# EAGLE schematic p8x-led-card (EAGLE 9.6.2)
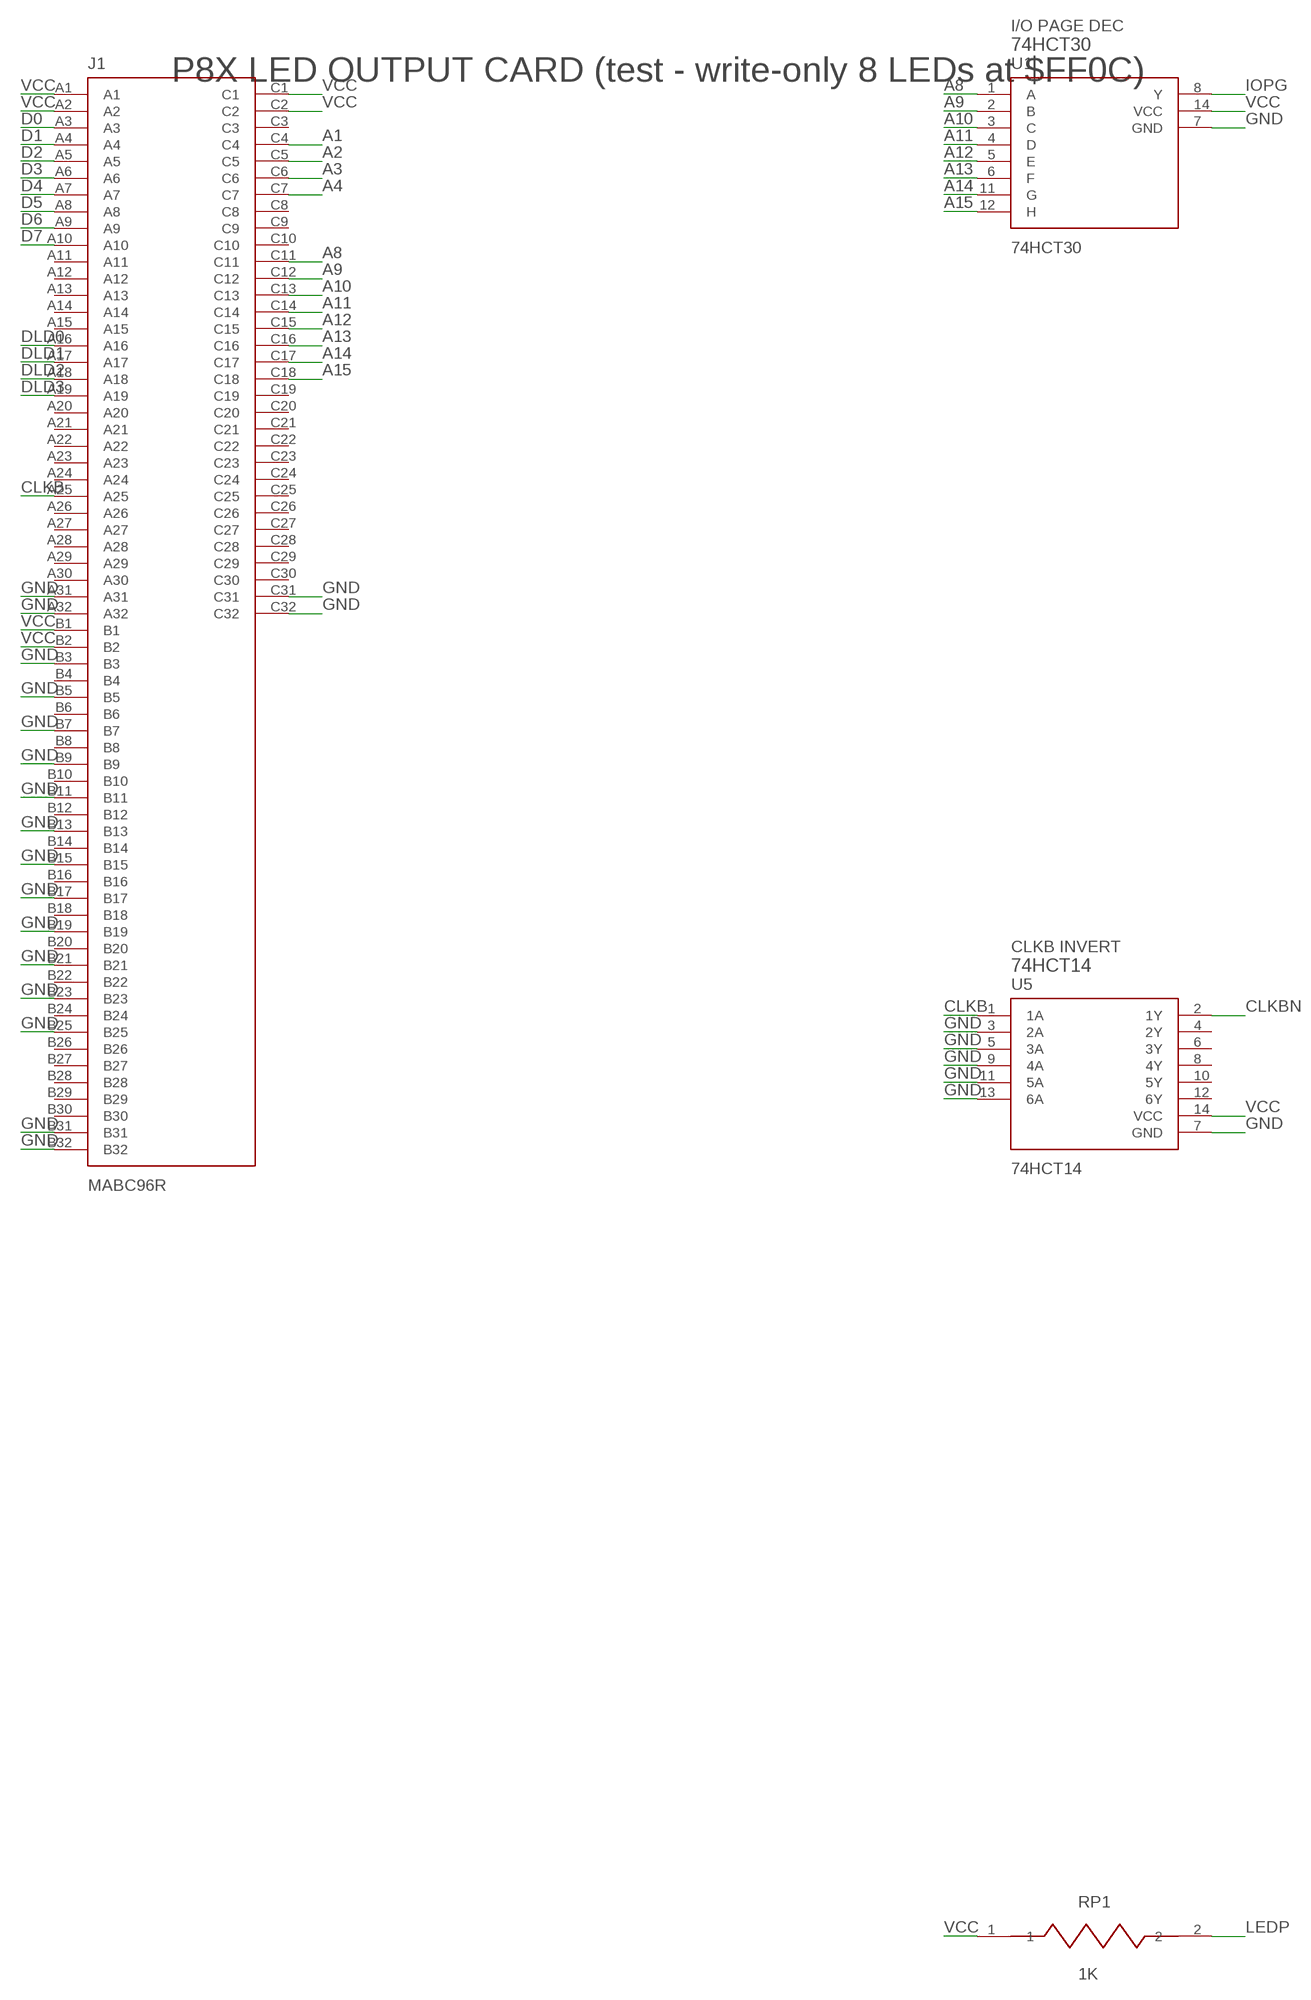
[diagram p0: schematic, sheet 1, part 1 of 3]
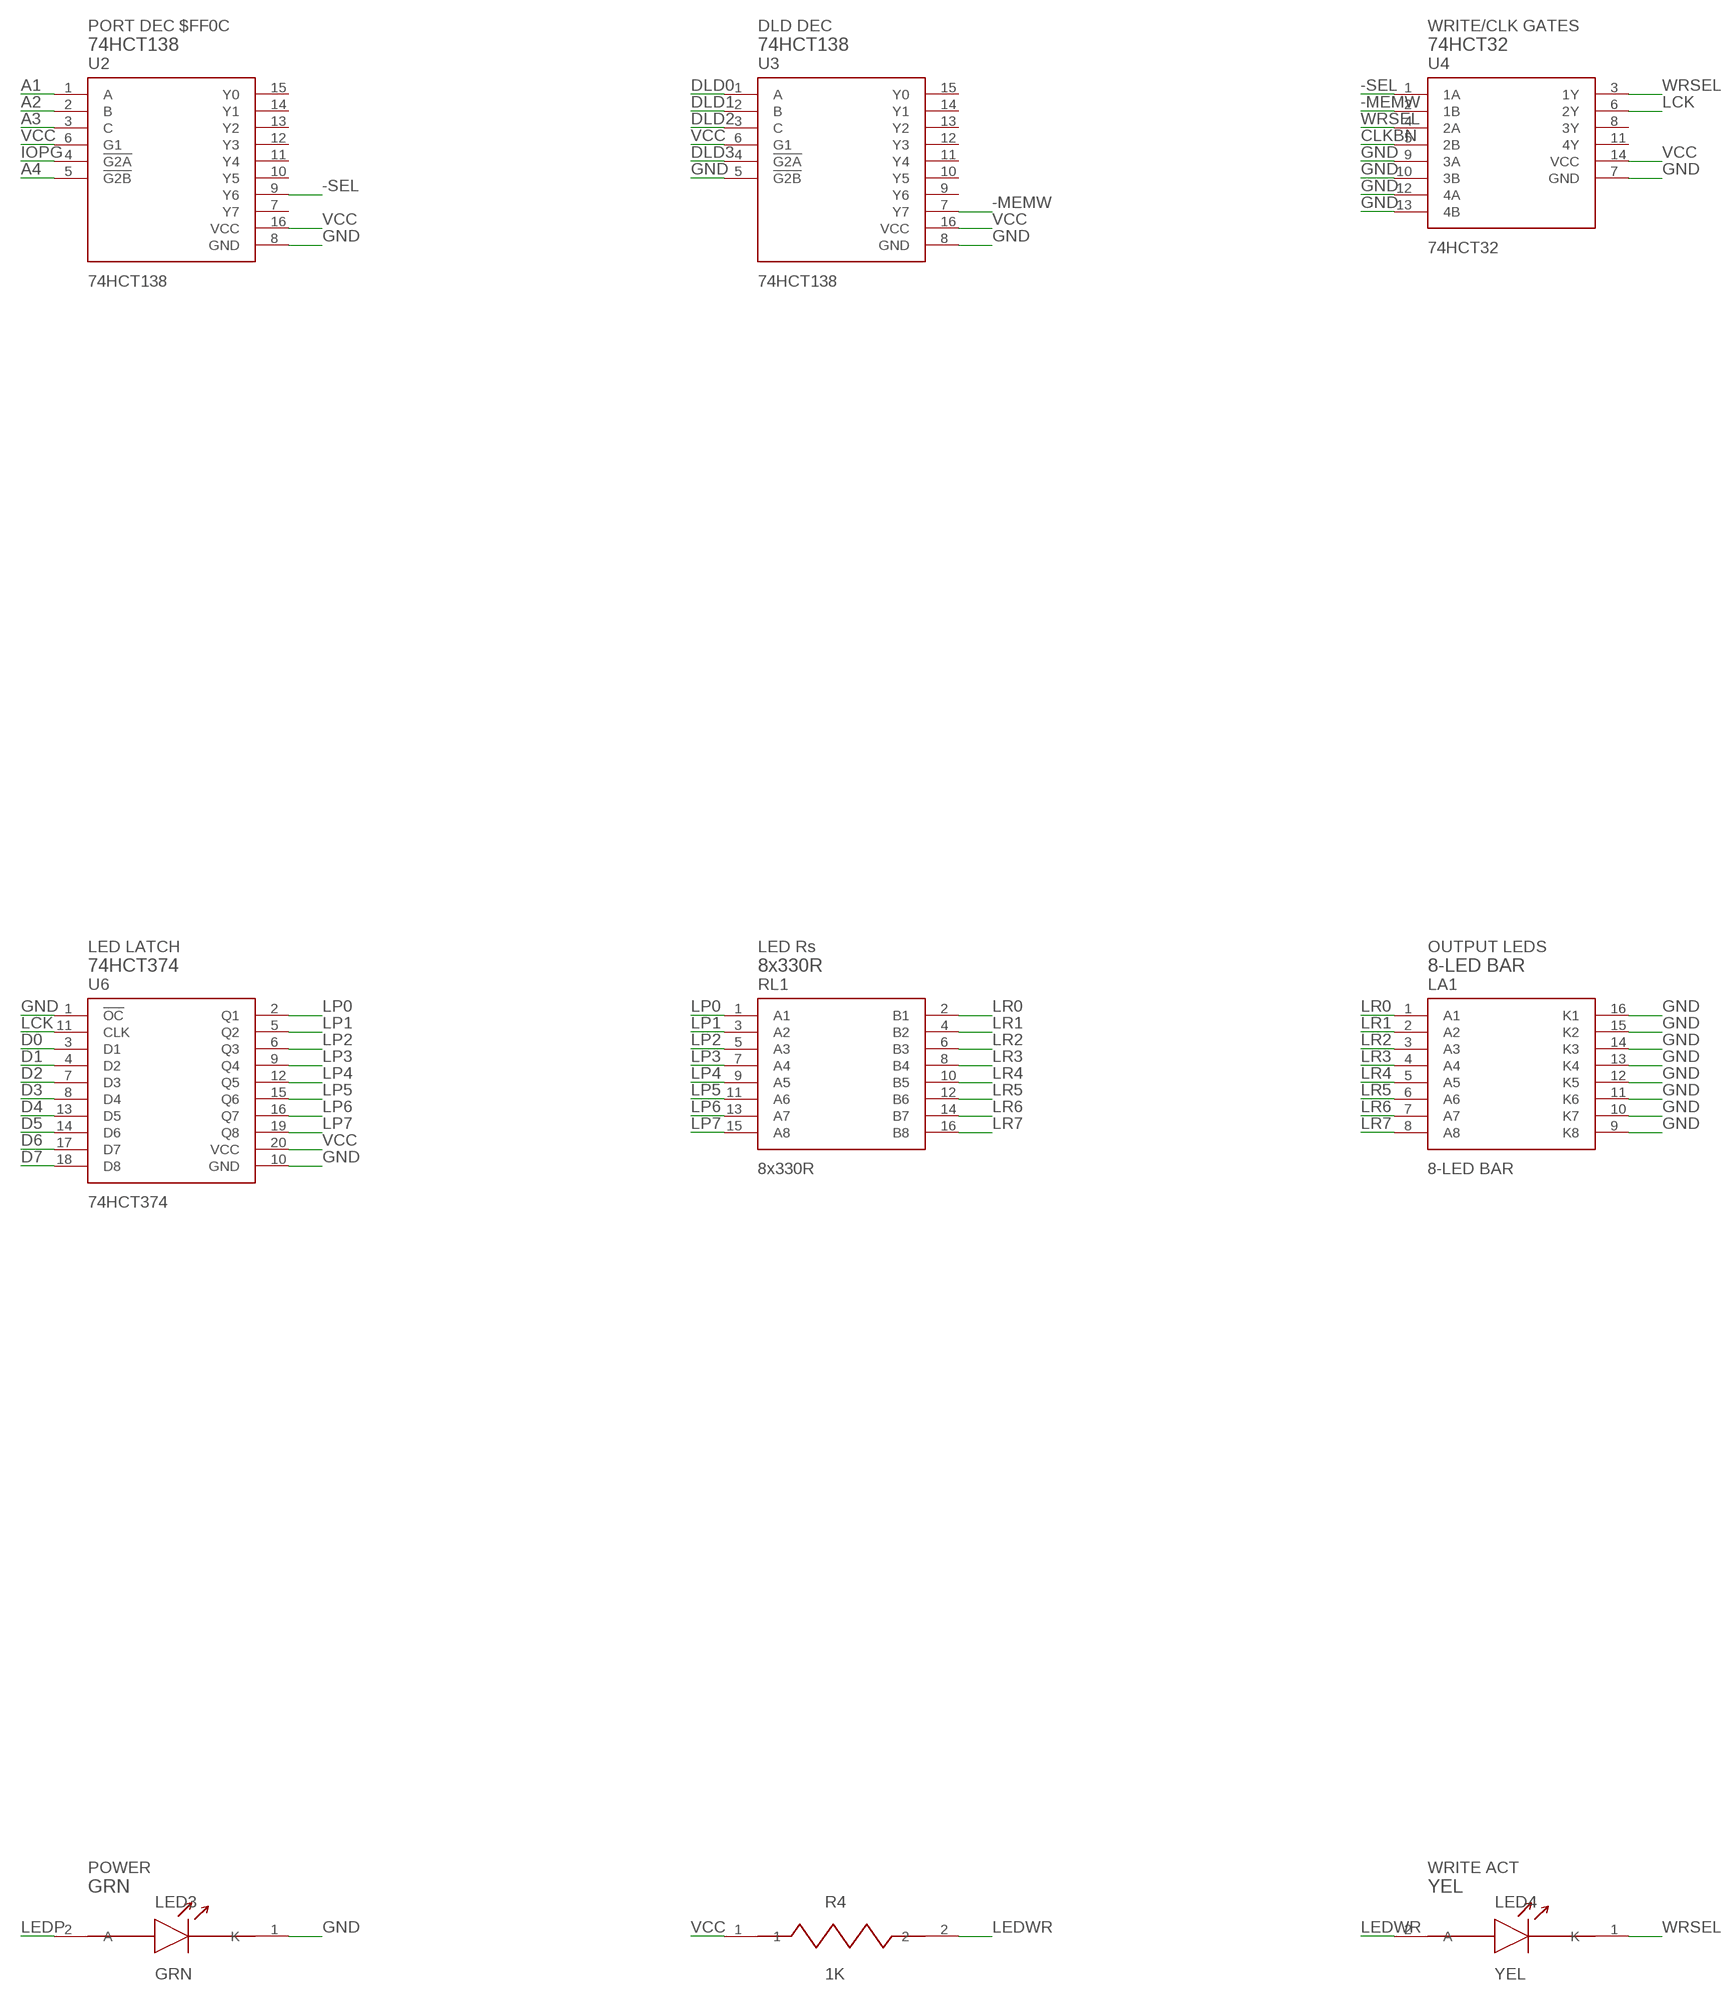
[diagram p1: schematic, sheet 1, part 2 of 3]
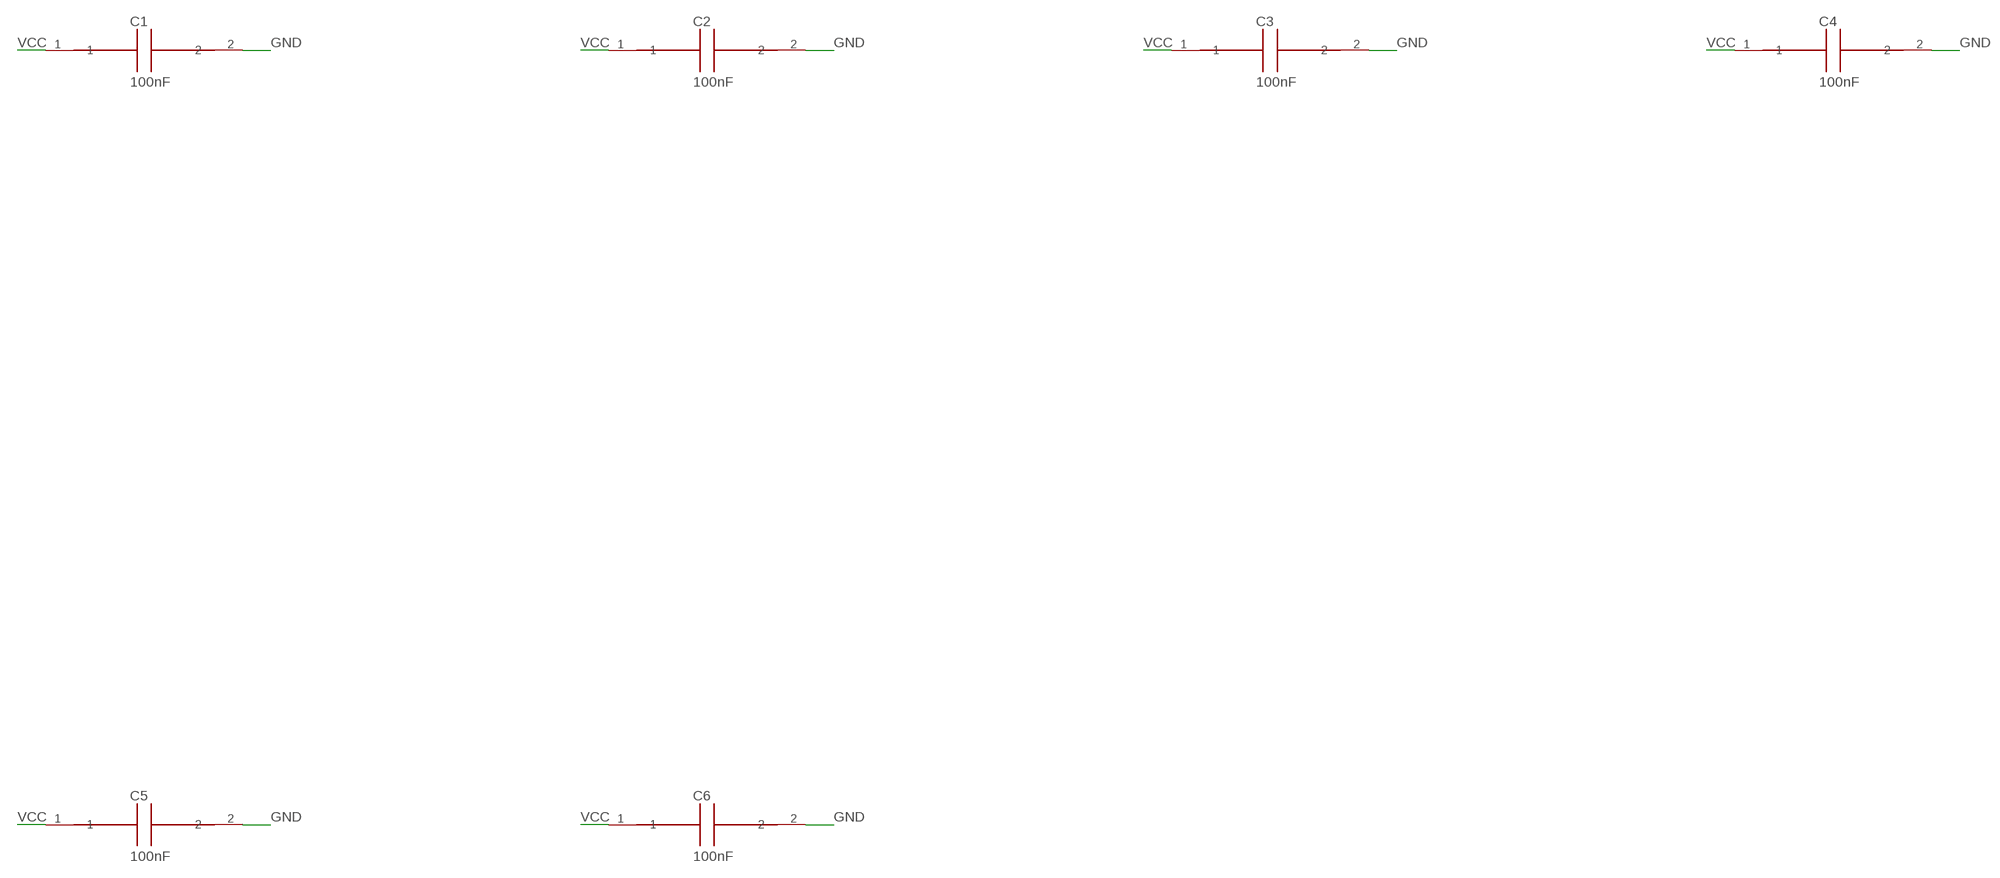
[diagram p2: schematic, sheet 1, part 3 of 3]

## Parts
C1  100nF  CAP1  [C_DISC1]
C2  100nF  CAP1  [C_DISC1]
C3  100nF  CAP1  [C_DISC1]
C4  100nF  CAP1  [C_DISC1]
C5  100nF  CAP1  [C_DISC1]
C6  100nF  CAP1  [C_DISC1]
J1  MABC96R  DIN96C  [MABC96R]
LA1  8-LED BAR  LEDARR8  [DIP16]
LED3  GRN  LED  [LED5]
LED4  YEL  LED  [LED5]
R4  1K  RES  [R_AXIAL]
RL1  8x330R  RNISO8  [SIP16]
RP1  1K  RES  [R_AXIAL]
U1  74HCT30  7430  [DIP14]
U2  74HCT138  74138  [DIP16]
U3  74HCT138  74138  [DIP16]
U4  74HCT32  GATES14  [DIP14]
U5  74HCT14  HEX14  [DIP14]
U6  74HCT374  74374  [DIP20]

## Nets
-MEMW: U3.7(Y7) U4.2(1B)
-SEL: U2.9(Y6) U4.1(1A)
A1: J1.C4 U2.1(A)
A2: J1.C5 U2.2(B)
A3: J1.C6 U2.3(C)
A4: J1.C7 U2.5(!G2B)
A8: J1.C11 U1.1(A)
A9: J1.C12 U1.2(B)
A10: J1.C13 U1.3(C)
A11: J1.C14 U1.4(D)
A12: J1.C15 U1.5(E)
A13: J1.C16 U1.6(F)
A14: J1.C17 U1.11(G)
A15: J1.C18 U1.12(H)
CLKB: J1.A25 U5.1(1A)
CLKBN: U4.5(2B) U5.2(1Y)
D0: J1.A3 U6.3(D1)
D1: J1.A4 U6.4(D2)
D2: J1.A5 U6.7(D3)
D3: J1.A6 U6.8(D4)
D4: J1.A7 U6.13(D5)
D5: J1.A8 U6.14(D6)
D6: J1.A9 U6.17(D7)
D7: J1.A10 U6.18(D8)
DLD0: J1.A16 U3.1(A)
DLD1: J1.A17 U3.2(B)
DLD2: J1.A18 U3.3(C)
DLD3: J1.A19 U3.4(!G2A)
GND: C1.2 C2.2 C3.2 C4.2 C5.2 C6.2 J1.A31 J1.A32 J1.B3 J1.B5 J1.B7 J1.B9 J1.B11 J1.B13 J1.B15 J1.B17 J1.B19 J1.B21 J1.B23 J1.B25 J1.B31 J1.B32 J1.C31 J1.C32 LA1.9(K8) LA1.10(K7) LA1.11(K6) LA1.12(K5) LA1.13(K4) LA1.14(K3) LA1.15(K2) LA1.16(K1) LED3.1(K) U1.7(GND) U2.8(GND) U3.5(!G2B) U3.8(GND) U4.7(GND) U4.9(3A) U4.10(3B) U4.12(4A) U4.13(4B) U5.3(2A) U5.5(3A) U5.7(GND) U5.9(4A) U5.11(5A) U5.13(6A) U6.1(!OC) U6.10(GND)
IOPG: U1.8(Y) U2.4(!G2A)
LCK: U4.6(2Y) U6.11(CLK)
LEDP: LED3.2(A) RP1.2
LEDWR: LED4.2(A) R4.2
LP0: RL1.1(A1) U6.2(Q1)
LP1: RL1.3(A2) U6.5(Q2)
LP2: RL1.5(A3) U6.6(Q3)
LP3: RL1.7(A4) U6.9(Q4)
LP4: RL1.9(A5) U6.12(Q5)
LP5: RL1.11(A6) U6.15(Q6)
LP6: RL1.13(A7) U6.16(Q7)
LP7: RL1.15(A8) U6.19(Q8)
LR0: LA1.1(A1) RL1.2(B1)
LR1: LA1.2(A2) RL1.4(B2)
LR2: LA1.3(A3) RL1.6(B3)
LR3: LA1.4(A4) RL1.8(B4)
LR4: LA1.5(A5) RL1.10(B5)
LR5: LA1.6(A6) RL1.12(B6)
LR6: LA1.7(A7) RL1.14(B7)
LR7: LA1.8(A8) RL1.16(B8)
VCC: C1.1 C2.1 C3.1 C4.1 C5.1 C6.1 J1.A1 J1.A2 J1.B1 J1.B2 J1.C1 J1.C2 R4.1 RP1.1 U1.14(VCC) U2.6(G1) U2.16(VCC) U3.6(G1) U3.16(VCC) U4.14(VCC) U5.14(VCC) U6.20(VCC)
WRSEL: LED4.1(K) U4.3(1Y) U4.4(2A)
Unconnected: J1.A11 J1.A12 J1.A13 J1.A14 J1.A15 J1.A20 J1.A21 J1.A22 J1.A23 J1.A24 J1.A26 J1.A27 J1.A28 J1.A29 J1.A30 J1.B4 J1.B6 J1.B8 J1.B10 J1.B12 J1.B14 J1.B16 J1.B18 J1.B20 J1.B22 J1.B24 J1.B26 J1.B27 J1.B28 J1.B29 J1.B30 J1.C3 J1.C8 J1.C9 J1.C10 J1.C19 J1.C20 J1.C21 J1.C22 J1.C23 J1.C24 J1.C25 J1.C26 J1.C27 J1.C28 J1.C29 J1.C30 U2.7(Y7) U2.10(Y5) U2.11(Y4) U2.12(Y3) U2.13(Y2) U2.14(Y1) U2.15(Y0) U3.9(Y6) U3.10(Y5) U3.11(Y4) U3.12(Y3) U3.13(Y2) U3.14(Y1) U3.15(Y0) U4.8(3Y) U4.11(4Y) U5.4(2Y) U5.6(3Y) U5.8(4Y) U5.10(5Y) U5.12(6Y)

## Notes on the sheet
- I/O PAGE DEC | PORT DEC $FF0C | DLD DEC | WRITE/CLK GATES
- 74HCT30 | 74HCT138 | 74HCT138 | 74HCT32
- P8X LED OUTPUT CARD (test - write-only 8 LEDs at $FF0C)
- CLKB INVERT | LED LATCH | LED Rs | OUTPUT LEDS
- 74HCT14 | 74HCT374 | 8x330R | 8-LED BAR
- POWER | WRITE ACT
- GRN | YEL

## Library data of the parts
C1-C6 = p8x:CAP1
J1 = p8x:DIN96C
LA1 = p8x:LEDARR8
LED3 LED4 = p8x:LED
R4 RP1 = p8x:RES
RL1 = p8x:RNISO8
U1 = p8x:7430
U2 U3 = p8x:74138
U4 = p8x:GATES14
U5 = p8x:HEX14
U6 = p8x:74374